# EAGLE design logger (EAGLE 7.2.0)
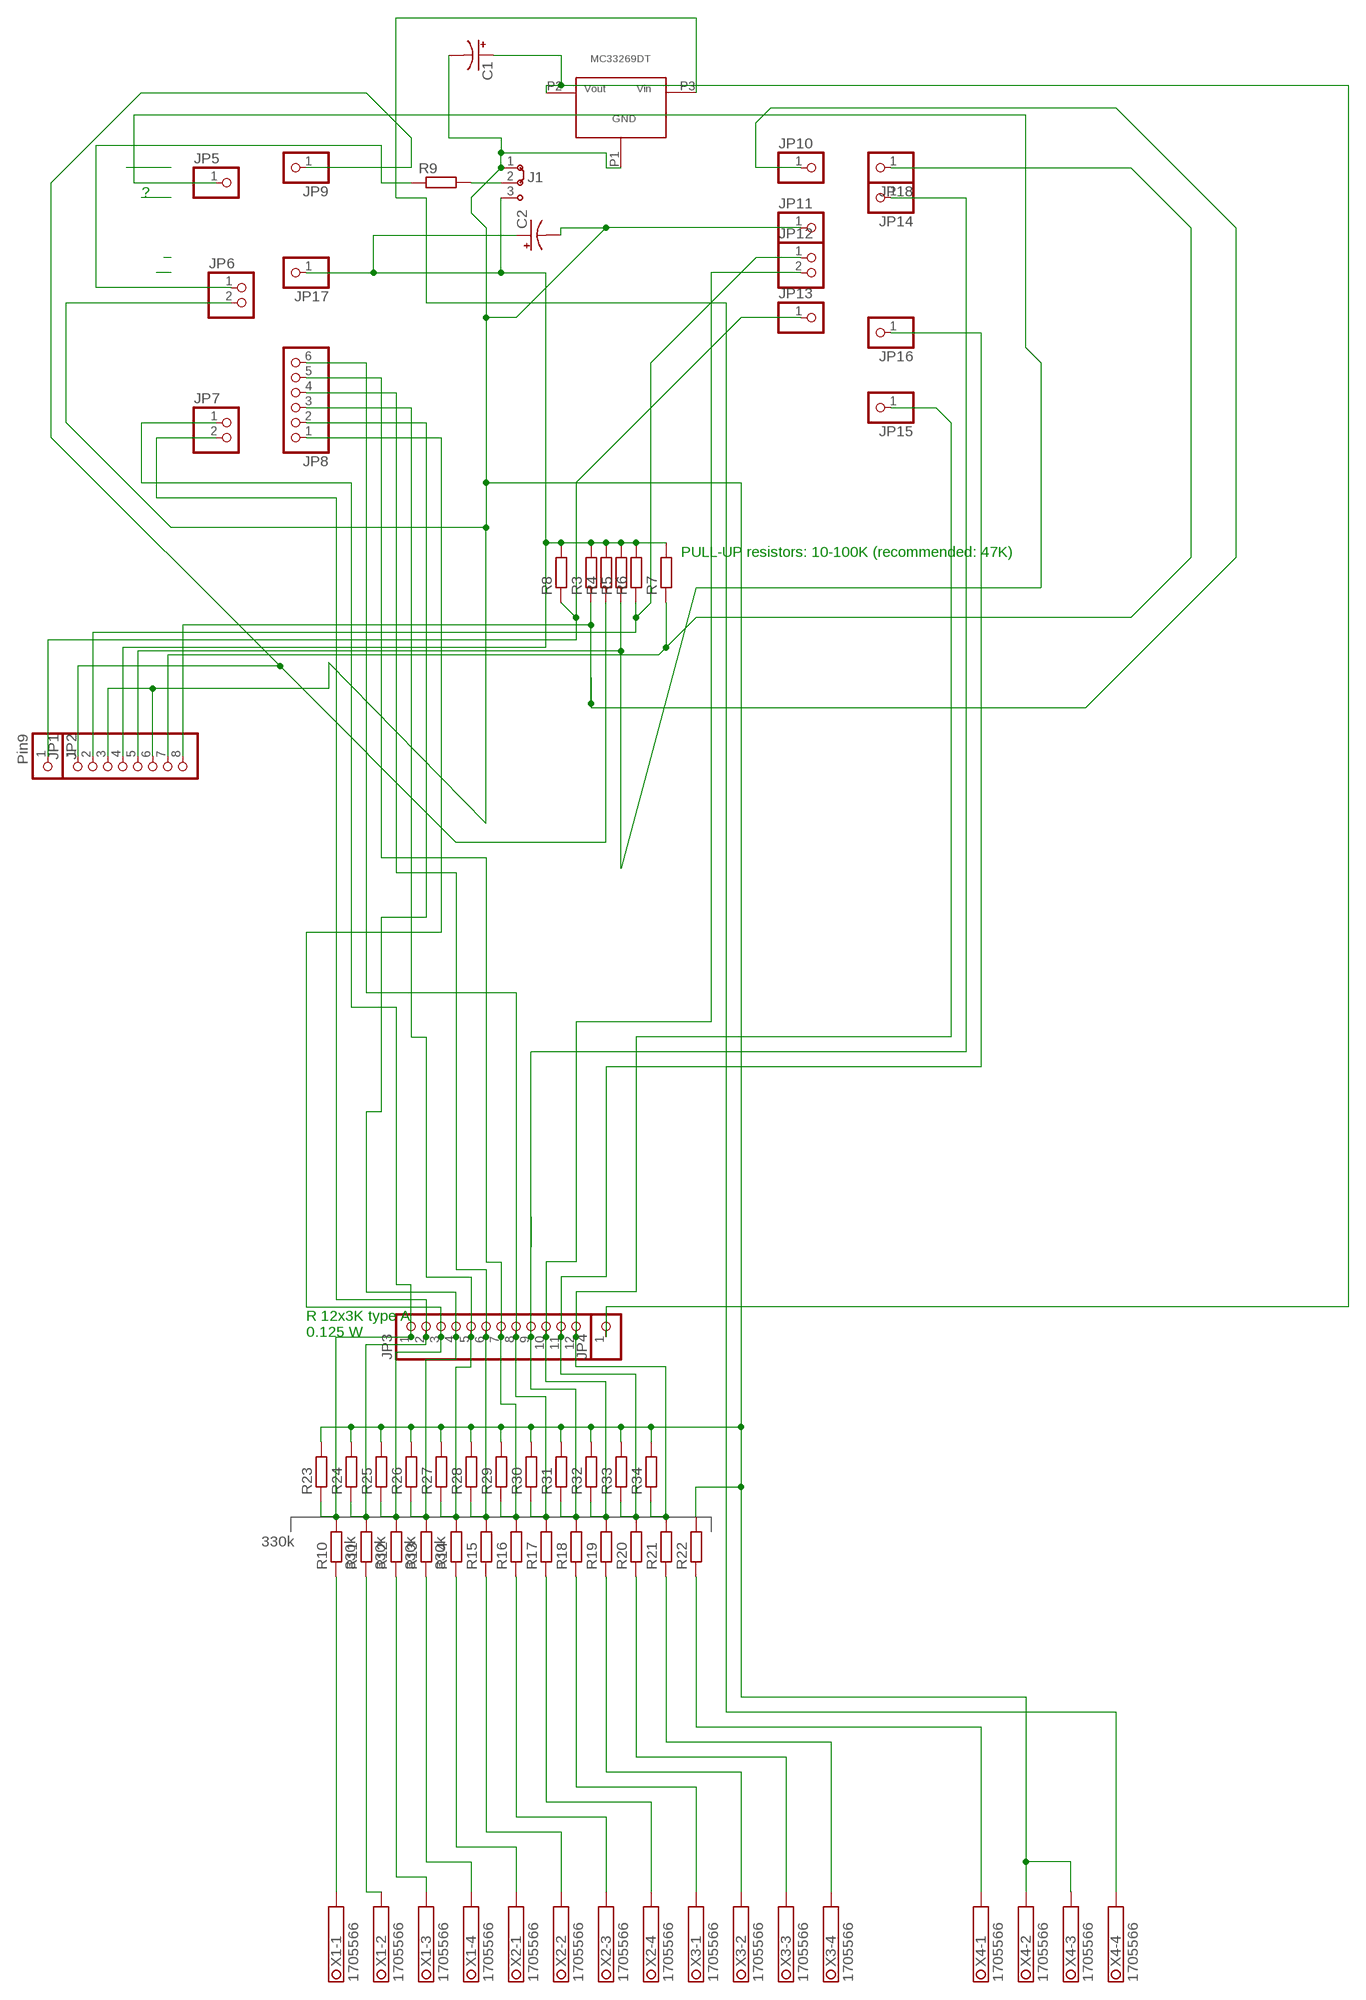
[diagram p0: schematic, sheet 1]

## Parts
C1  CPOL-USE5-10.5  [E5-10,5]
C2  CPOL-USE5-10.5  [E5-10,5]
J1  J2X2MM  [04C]
JP1  PINHD-1X8  [1X08]
JP2  Pin9  PINHD-1X1  [1X01]
JP3  PINHD-1X12  [1X12]
JP4  PINHD-1X1  [1X01]
JP5  PINHD-1X1  [1X01]
JP6  PINHD-1X2  [1X02]
JP7  PINHD-1X2  [1X02]
JP8  PINHD-1X6  [1X06]
JP9  PINHD-1X1  [1X01]
JP10  PINHD-1X1  [1X01]
JP11  PINHD-1X1  [1X01]
JP12  PINHD-1X2  [1X02]
JP13  PINHD-1X1  [1X01]
JP14  PINHD-1X1  [1X01]
JP15  PINHD-1X1  [1X01]
JP16  PINHD-1X1  [1X01]
JP17  PINHD-1X1  [1X01]
JP18  PINHD-1X1  [1X01]
R3  R-EU_R1206  [R1206]
R4  R-EU_R1206  [R1206]
R5  R-EU_R1206  [R1206]
R6  R-EU_R1206  [R1206]
R7  R-EU_R1206  [R1206]
R8  R-EU_R1206  [R1206]
R9  R-EU_R1206  [R1206]
R10  330k  R-EU_0207/15  [0207/15]
R11  330k  R-EU_0207/15  [0207/15]
R12  330k  R-EU_0207/15  [0207/15]
R13  330k  R-EU_0207/15  [0207/15]
R14  R-EU_0207/15  [0207/15]
R15  R-EU_0207/15  [0207/15]
R16  R-EU_0207/15  [0207/15]
R17  R-EU_0207/15  [0207/15]
R18  R-EU_0207/15  [0207/15]
R19  R-EU_0207/15  [0207/15]
R20  R-EU_0207/15  [0207/15]
R21  R-EU_0207/15  [0207/15]
R22  R-EU_0207/15  [0207/15]
R23  R-EU_R1206  [R1206]
R24  R-EU_R1206  [R1206]
R25  R-EU_R1206  [R1206]
R26  R-EU_R1206  [R1206]
R27  R-EU_R1206  [R1206]
R28  R-EU_R1206  [R1206]
R29  R-EU_R1206  [R1206]
R30  R-EU_R1206  [R1206]
R31  R-EU_R1206  [R1206]
R32  R-EU_R1206  [R1206]
R33  R-EU_R1206  [R1206]
R34  R-EU_R1206  [R1206]
U$2  MC33269DT  [MC33269DT]
X1  1705566  [1705566]
X2  1705566  [1705566]
X3  1705566  [1705566]
X4  1705566  [1705566]

## Nets
N$3: JP1.7 JP18.1 R7.1
N$4: U$2.P3(VIN) X4.4.1 X4.4.2
N$5: JP6.1 R9.1
N$6: C1.- C2.- J1.1 JP1.3 JP1.6 JP6.2 JP11.1 R22.2 R23.2 R24.2 R25.2 R26.2 R27.2 R28.2 R29.2 R30.2 R31.2 R32.2 R33.2 R34.2 U$2.P1(GND) X4.2.1 X4.2.2 X4.3.1 X4.3.2
N$7: JP2.1 JP13.1 R8.1
N$8: JP1.1 JP9.1 R4.1
N$9: JP1.2 JP12.1 R6.1
N$11: JP1.5 JP5.1 R5.1
N$12: JP1.8 JP10.1 R3.1
N$13: JP3.8 JP8.6 R17.2 R30.1
N$14: JP3.7 JP8.5 R16.2 R29.1
N$15: JP3.6 JP8.4 R15.2 R28.1
N$16: JP3.5 JP8.3 R14.2 R27.1
N$18: JP3.2 JP7.2 R11.2 R24.1
N$20: R22.1 X4.1.1 X4.1.2
N$21: C2.+ J1.3 JP1.4 JP17.1 R3.2 R4.2 R5.2 R6.2 R7.2 R8.2
N$22: JP3.10 JP12.2 R19.2 R32.1
N$23: JP3.3 JP8.1 R12.2 R25.1
N$24: JP3.11 JP16.1 R20.2 R33.1
N$25: JP3.1 JP7.1 R10.2 R23.1
N$26: C1.+ JP4.1 U$2.P2(VOUT)
N$27: J1.2 R9.2
N$30: JP3.4 JP8.2 R13.2 R26.1
N$37: JP3.12 JP15.1 R21.2 R34.1
N$38: JP3.9 JP14.1 R18.2 R31.1
N$42: R10.1 X1.1.1 X1.1.2
N$43: R11.1 X1.2.1 X1.2.2
N$44: R12.1 X1.3.1 X1.3.2
N$45: R13.1 X1.4.1 X1.4.2
N$46: R14.1 X2.1.1 X2.1.2
N$47: R15.1 X2.2.1 X2.2.2
N$48: R16.1 X2.3.1 X2.3.2
N$49: R17.1 X2.4.1 X2.4.2
N$50: R18.1 X3.1.1 X3.1.2
N$51: R19.1 X3.2.1 X3.2.2
N$52: R20.1 X3.3.1 X3.3.2
N$53: R21.1 X3.4.1 X3.4.2

## Notes on the sheet
- ?
- PULL-UP resistors: 10-100K (recommended: 47K)
- R 12x3K type A
  0.125 W
- 330k

## Library data of the parts
C1 C2 = resistor:CPOL-US: POLARIZED CAPACITOR, American symbol
J1 = jumper:J2: Jumper switch 2 x 2.5 mm
JP1 = pinhead:PINHD-1X8: PIN HEADER
JP2 JP4 JP5 JP9-JP11 JP13-JP18 = pinhead:PINHD-1X1: PIN HEADER
JP3 = pinhead:PINHD-1X12: PIN HEADER
JP6 JP7 JP12 = pinhead:PINHD-1X2: PIN HEADER
JP8 = pinhead:PINHD-1X6: PIN HEADER
R3-R34 = resistor:R-EU_: RESISTOR, European symbol
U$2 = mc33269dt:MC33269DT
X1-X4 = con-phoenix-3.81:1705566: MKDSD 1,5/ 4-3,81 Printklemme Nennstrom: 8 A Bemessungsspannung: 200 V Raster: 3,81 mm Polzahl: 4 Montageart: Löten Anschlussart: Schraubanschluss Anschlussrichtung vom Leiter zur Platine: 0° Source: http://eshop.phoenixcontact.com .. 1705566.pdf; OC_FARNELL: unknown; OC_NEWARK: unknown

## Board
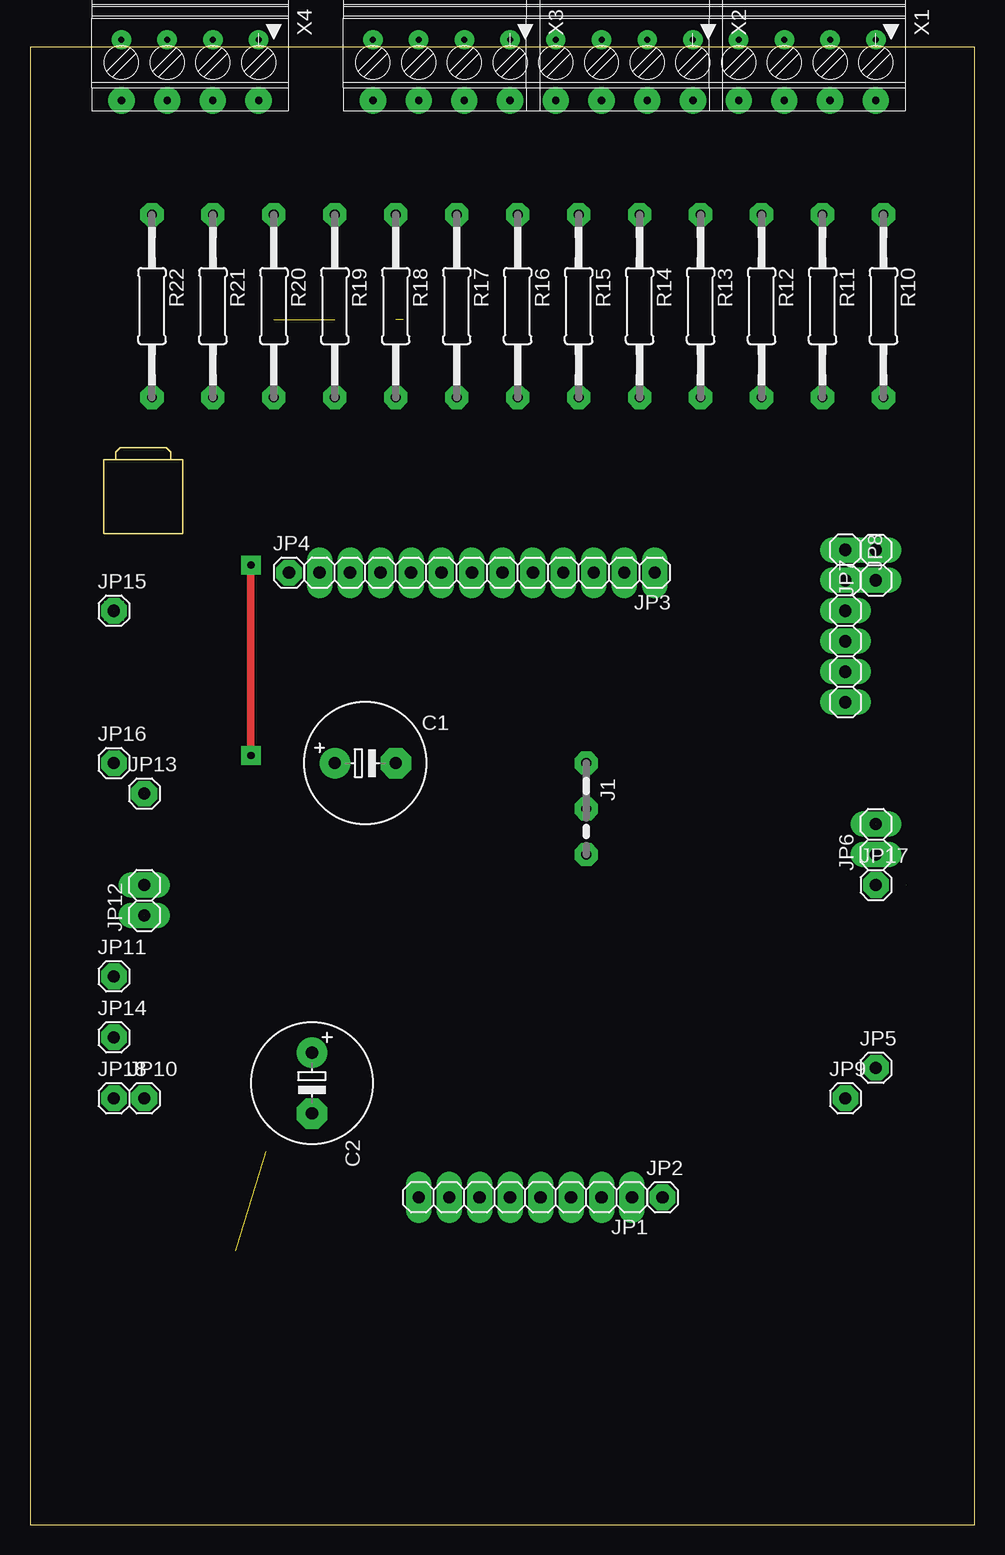
[diagram p1: board, top side]
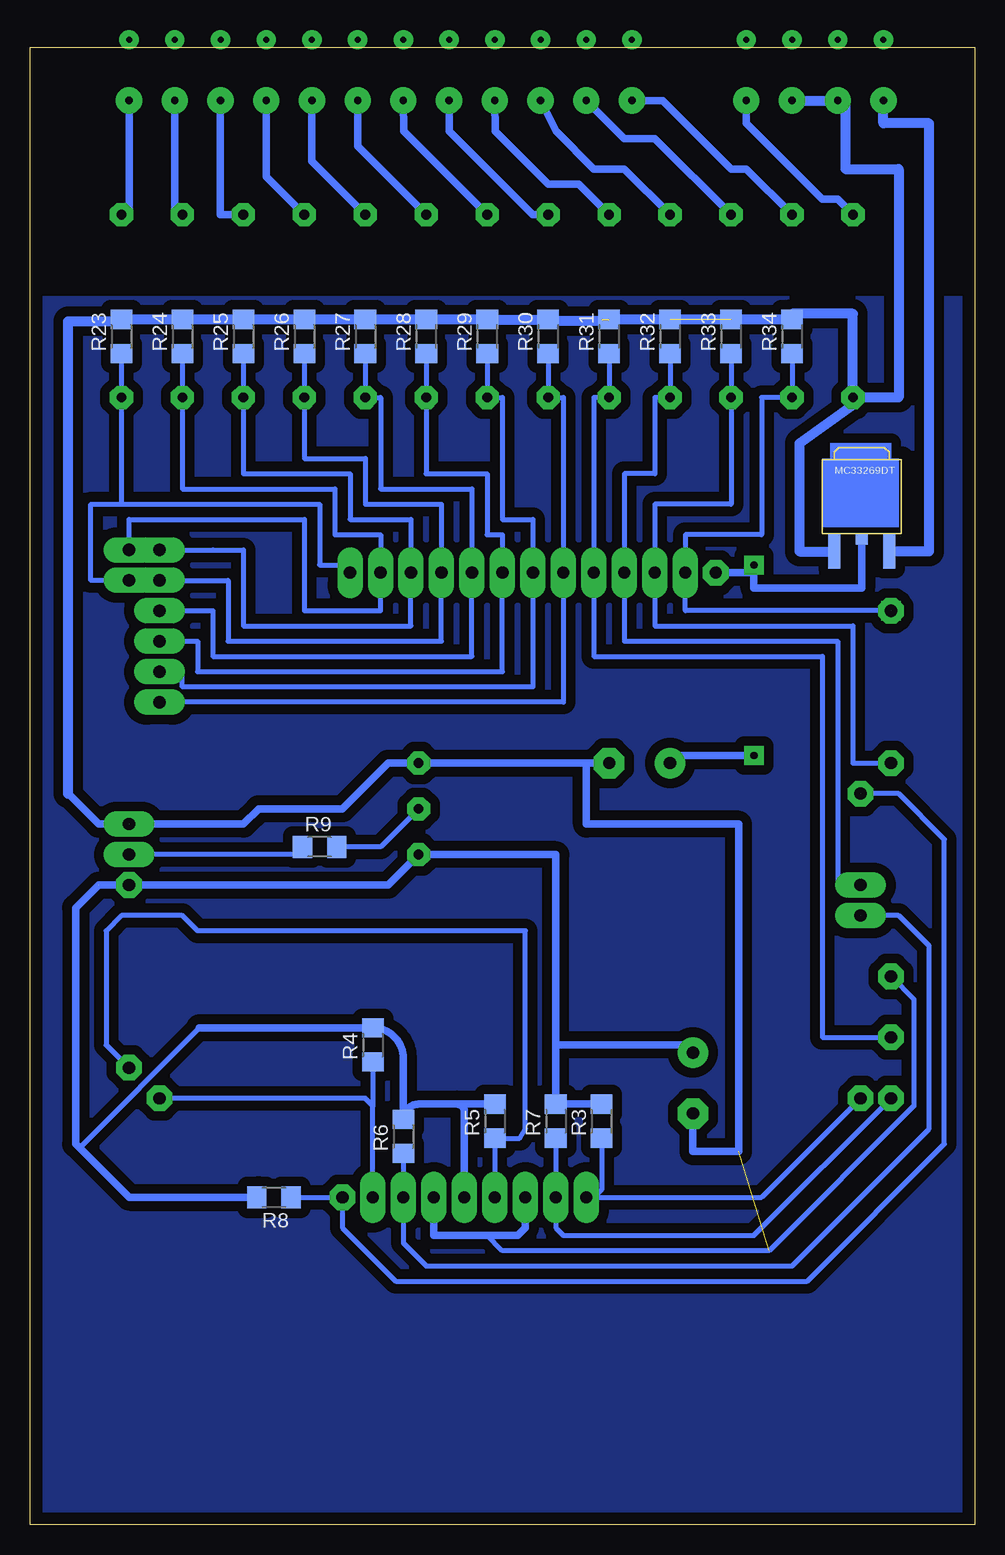
[diagram p2: board, bottom side, seen from below]

Size 78.74 x 123.19 mm. Coordinates in mm from the lower left corner, seen from the top.
Outline: 0,0 78.74,0 78.74,123.19 0,123.19 0,0
Copper layers (1*16): Top 0.035mm / dielectric 1.5mm / Bottom 0.035mm
Design rules "default *": minimum track width 10mil, minimum drill 24mil, track to track 8mil, track to pad 8mil, pad to pad 8mil, via to via 8mil, smd to smd 8mil, copper to edge 40mil, drill to drill 8mil, minimum pad ring 22mil, minimum via ring 20mil, stop-mask expansion 4mil, vias tented up to drill 0mil, thermal gap 10mil

### Footprints (pad centres in the part's own frame; a part is rotated, then mirrored left to right if it is on the bottom)
E5-10,5 = drill 1.016 pad 2.54: + -2.54,0 | drill 1.016 pad 2.54 octagon: - 2.54,0
04C = drill 0.813 pad 1.905 octagon: 1 -1.905,0; 2 1.905,0; 3 5.715,0
1X08 = drill 1.016 long: 1 -8.89,0; 2 -6.35,0; 3 -3.81,0; 4 -1.27,0; 5 1.27,0; 6 3.81,0; 7 6.35,0; 8 8.89,0
1X01 = drill 1.016 octagon: 1 0,0
1X12 = drill 1.016 long: 1 -13.97,0; 2 -11.43,0; 3 -8.89,0; 4 -6.35,0; 5 -3.81,0; 6 -1.27,0; 7 1.27,0; 8 3.81,0; 9 6.35,0; 10 8.89,0; 11 11.43,0; 12 13.97,0
1X02 = drill 1.016 long: 1 -1.27,0; 2 1.27,0
1X06 = drill 1.016 long: 1 -6.35,0; 2 -3.81,0; 3 -1.27,0; 4 1.27,0; 5 3.81,0; 6 6.35,0
R1206 = smd 1.6 x 1.803: 1 -1.422,0; 2 1.422,0
0207/15 = drill 0.813 octagon: 1 -7.62,0; 2 7.62,0
MC33269DT = smd 1 x 2.8: P1 -2.2,-4.59; P3 2.38,-4.59 | smd 1 x 0.8: P2 0.09,-3.59
1705566 = drill 0.5 pad 0.9: 1.1 -5.715,-1.25; 1.2 -5.715,3.83; 2.1 -1.905,-1.25; 2.2 -1.905,3.83; 3.1 1.905,-1.25; 3.2 1.905,3.83; 4.1 5.715,-1.25; 4.2 5.715,3.83

### Placement (x,y rotation side)
C1  27.94,63.5 0 top
C2  23.5,36.83 270 top
J1  46.35,61.59 270 top
JP1  41.27,27.3 180 top
JP2  52.7,27.3 0 top
JP3  38.1,79.38 180 top
JP4  21.59,79.38 0 top
JP5  70.48,38.1 0 top
JP6  70.48,57.15 90 top
JP7  70.48,80.01 90 top
JP8  67.94,74.93 270 top
JP9  67.94,35.56 0 top
JP10  9.53,35.56 0 top
JP11  6.99,45.72 0 top
JP12  9.53,52.07 90 top
JP13  9.53,60.96 0 top
JP14  6.99,40.64 0 top
JP15  6.99,76.2 0 top
JP16  6.99,63.5 0 top
JP17  70.48,53.34 0 top
JP18  6.99,35.56 0 top
R3  31.11,33.66 90 bottom
R4  50.16,40.01 90 bottom
R5  40.01,33.66 90 bottom
R6  47.62,32.38 90 bottom
R7  34.92,33.66 90 bottom
R8  58.42,27.3 180 bottom
R9  54.61,56.52 0 bottom
R10  71.12,101.6 270 top
R11  66.04,101.6 270 top
R12  60.96,101.6 270 top
R13  55.88,101.6 270 top
R14  50.8,101.6 270 top
R15  45.72,101.6 270 top
R16  40.64,101.6 270 top
R17  35.56,101.6 270 top
R18  30.48,101.6 270 top
R19  25.4,101.6 270 top
R20  20.32,101.6 270 top
R21  15.24,101.6 270 top
R22  10.16,101.6 270 top
R23  71.12,99.06 90 bottom
R24  66.04,99.06 90 bottom
R25  60.96,99.06 90 bottom
R26  55.88,99.06 90 bottom
R27  50.8,99.06 90 bottom
R28  45.72,99.06 90 bottom
R29  40.64,99.06 90 bottom
R30  35.56,99.06 90 bottom
R31  30.48,99.06 90 bottom
R32  25.4,99.06 90 bottom
R33  20.32,99.06 90 bottom
R34  15.24,99.06 90 bottom
U$2  9.53,85.72 0 bottom
X1  64.77,122.56 180 top
X2  49.53,122.56 180 top
X3  34.29,122.56 180 top
X4  13.34,122.56 180 top

### Tracks (layer width: path | path; a pad name or v marks a point on that pad's centre or on a via)
N$1
  pour Bottom (isolate 0.813): 0,102.23 78.74,102.23 78.74,0 0,0
N$3
  Bottom 0.406: 18.41,24.13 34.29,24.13 34.92,24.77 JP1.7 R7.1 | JP18.1 18.41,24.13 | 18.41,24.13
N$4
  Bottom 0.813: X4.4.2 7.62,116.84 3.81,116.84 3.81,81.14 U$2.P3
N$5
  Bottom 0.406: R9.1 56.67,55.88 69.22,55.88 JP6.1
N$6  (4 unrouted)
  Bottom 0.406: JP11.1 5.08,43.81 5.08,34.92 17.14,22.86 39.37,22.86 40.64,24.13 | JP6.2 68.58,58.42
  Bottom 0.61: JP1.3 45.09,24.13 40.64,24.13 38.1,24.13 37.47,24.77 JP1.6 | 75.56,60.96 73.03,58.42 JP6.2 | 32.38,63.5 J1.1 48.9,63.5 52.7,59.69 59.69,59.69 60.96,58.42 JP6.2 | 32.38,63.5 C1.- | C2.- 23.5,31.11 19.68,31.11 19.68,58.42 32.38,58.42 32.38,63.5
  Bottom 0.813: R22.2 10.16,93.34 14.61,90.17 14.61,81.14 U$2.P1 | R22.2 10.16,100.97 15.24,100.97 R34.2 R32.2 31.11,100.48 31.11,100.33 35.56,100.33 R30.2 R29.2 R28.2 R27.2 R26.2 R25.2 R24.2 R23.2 71.12,100.33 75.56,100.33 75.56,60.96 | X4.3.2 X4.2.2 10.79,118.72 10.79,113.03 6.35,113.03 6.35,93.98 R22.2
N$7  (1 unrouted)
  Bottom 0.406: JP2.1 52.7,26.67 | 52.7,26.67 52.7,24.77 48.26,20.32 13.97,20.32 2.54,31.75 2.54,57.15 6.35,60.96 JP13.1 | R8.1 53.34,27.3 52.7,26.67
N$8
  Bottom 0.406: JP1.1 50.16,34.92 | 50.16,34.92 50.8,35.56 67.31,35.56 JP9.1 | R4.1 50.16,34.92 | JP9.1
N$9  (1 unrouted)
  Bottom 0.406: R6.1 JP1.2 47.62,23.5 45.72,21.59 15.24,21.59 3.81,33.02 3.81,48.26 6.35,50.8 JP12.1
N$11
  Bottom 0.406: JP1.5 R5.1 37.95,32.23 37.47,33.02 37.47,49.53 64.77,49.53 66.04,50.8 71.12,50.8 72.39,49.53 72.39,40 JP5.1
N$12
  Bottom 0.406: JP1.8 31.75,27.3 | 31.75,27.3 17.78,27.3 | R3.1 31.11,27.94 31.75,27.3 | JP10.1 17.78,27.3 | 17.78,27.3
  Bottom 0.61: JP10.1
N$13
  Bottom 0.406: R30.1 R17.2 34.29,93.98 JP3.8 34.29,68.58 67.31,68.58 JP8.6
N$14
  Bottom 0.406: R29.1 R16.2 39.37,93.98 39.37,83.82 36.83,83.82 JP3.7 36.83,69.85 66.04,69.85 66.04,71.12 67.31,71.12 JP8.5
N$15
  Bottom 0.406: R28.1 R15.2 45.72,87.63 40.64,87.63 40.64,82.55 39.37,82.55 JP3.6 39.37,71.12 64.77,71.12 64.77,73.66 66.67,73.66 66.68,73.66 JP8.4
N$16
  Bottom 0.406: R27.1 R14.2 49.53,93.98 49.53,86.36 41.91,86.36 JP3.5 41.91,72.39 63.5,72.39 63.5,76.2 66.04,76.2 JP8.3
N$18
  Bottom 0.406: R24.1 R11.2 66.04,86.36 53.34,86.36 53.34,82.55 49.53,82.55 JP3.2 49.53,76.2 55.88,76.2 55.88,83.82 70.49,83.82 70.49,83.19 70.48,83.18 JP7.2
N$20
  Bottom 0.61: X4.1.2 19.05,116.84 12.7,110.49 11.43,110.49 R22.1
N$21  (1 unrouted)
  Bottom 0.406: 64.62,41.43 74.61,31.43
  Bottom 0.61: 48.9,53.34 | 48.9,53.34 J1.3 34.92,55.88 34.92,40.01 | 73.03,53.34 74.93,51.44 74.93,31.75 74.61,31.43 70.48,27.3 60.33,27.3 59.69,27.94 59.69,27.46 R8.2 | 64.62,41.43 R4.2 arc90 47.62,38.89 R6.2 arc90 46.35,35.08 43.18,35.08 | 43.18,35.08 R5.2 | JP1.4 42.55,34.44 arc-90 43.18,35.08 | R3.2 R7.2 34.92,40.01 | C2.+ 23.5,40.01 34.92,40.01 | 73.03,53.34 JP17.1 68.58,53.34 48.9,53.34
N$22
  Bottom 0.406: R32.1 R19.2 26.67,93.98 26.67,87.63 29.21,87.63 JP3.10 29.21,73.66 11.43,73.66 11.43,53.34 JP12.2 | JP12.2
N$23
  Bottom 0.406: R25.1 R12.2 60.96,87.63 52.07,87.63 52.07,83.82 46.99,83.82 JP3.3 46.99,74.93 60.96,74.93 60.96,81.28 63.5,81.28 JP8.1
N$24
  Bottom 0.406: R33.1 R20.2 20.32,85.09 26.67,85.09 JP3.11 26.67,74.93 10.16,74.93 10.16,63.5 JP16.1
N$25
  Bottom 0.406: 71.12,85.09 73.66,85.09 73.66,78.74 71.75,78.74 JP7.1 | 71.12,85.09 54.61,85.09 54.61,80.01 52.07,80.01 JP3.1 | 71.12,85.09 R10.2 R23.1
N$26  (via drill 0.6)
  Top 0.61: v18.41,64.14 v18.41,80.01
  Bottom 0.61: U$2.P2 9.44,78.11 18.41,78.11 18.41,79.38 | 18.41,79.38 JP4.1 | C1.+ 25.4,64.14 v18.41,64.14 | v18.41,80.01 18.41,79.38
N$27
  Bottom 0.406: J1.2 49.53,56.52 R9.2
N$28  (via drill 0.6 pad 2.18)
  other vias: 47.62,118.75
N$30
  Bottom 0.406: R26.1 R13.2 55.88,88.9 50.8,88.9 50.8,85.09 44.45,85.09 JP3.4 44.45,73.66 62.23,73.66 62.23,78.74 66.04,78.74 JP8.2
N$31  (via drill 0.6 pad 2.18)
  other vias: 51.44,118.75
N$32  (via drill 0.6 pad 2.18)
  other vias: 55.24,118.75
N$33  (via drill 0.6 pad 2.18)
  other vias: 59.05,118.75
N$34  (via drill 0.6 pad 2.18)
  other vias: 62.87,118.75
N$35  (via drill 0.6 pad 2.18)
  other vias: 66.67,118.75
N$36  (via drill 0.6 pad 2.18)
  other vias: 70.48,118.75
N$37  (via drill 0.6)  (1 unrouted)
  Bottom 0.406: R34.1 R21.2 17.78,93.98 17.78,82.55 24.13,82.55 JP3.12 24.13,76.2 JP15.1
  other vias: 6.98,76.2
N$38
  Bottom 0.406: R31.1 R18.2 31.75,93.98 JP3.9 31.75,72.39 12.7,72.39 12.7,40.64 JP14.1 | JP14.1 | 6.35,40.64 JP14.1
N$39  (via drill 0.6 pad 2.18)
  other vias: 43.81,118.75
N$40  (via drill 0.6 pad 2.18)
  other vias: 40.01,118.75
N$41  (via drill 0.6 pad 2.18)
  other vias: 36.2,118.75
N$42
  Bottom 0.61: R10.1 70.48,109.22 X1.1.2
N$43
  Bottom 0.61: R11.1 66.67,109.22 X1.2.2
N$44
  Bottom 0.61: X1.3.2 62.87,109.22 R12.1
N$45
  Bottom 0.61: X1.4.2 59.05,112.39 R13.1
N$46
  Bottom 0.61: X2.1.2 55.24,113.67 R14.1
N$47
  Bottom 0.61: X2.2.2 51.44,114.94 R15.1
N$48
  Bottom 0.61: X2.3.2 47.6,116.19 R16.1
N$49
  Bottom 0.61: X2.4.2 43.8,116.19 36.83,109.22 R17.1
N$50
  Bottom 0.61: X3.1.2 39.98,116.19 35.56,111.76 33.02,111.76 R18.1
N$51
  Bottom 0.61: X3.2.2 34.91,116.19 31.75,113.03 29.21,113.03 R19.1
N$52
  Bottom 0.61: X3.3.2 32.37,118.72 29.21,115.57 26.67,115.57 R20.1
N$53
  Bottom 0.61: X3.4.2 26.02,118.72 20.32,113.03 19.05,113.03 R21.1
N$54  (via drill 0.6 pad 2.18)
  other vias: 32.38,118.75
N$55  (via drill 0.6 pad 2.18)
  other vias: 28.57,118.75
N$56  (via drill 0.6 pad 2.18)
  other vias: 19.05,118.75
N$57  (via drill 0.6 pad 2.18)
  other vias: 15.24,118.75
N$58  (via drill 0.6 pad 2.18)
  other vias: 11.43,118.75
N$59  (via drill 0.6 pad 2.18)
  other vias: 7.62,118.75
(copper drawn outside any net)
  shapes: Bottom area x2